# Altium schematic sheet Mechanical.SchDoc
size A4; CompanyName: TechOcean Sp. z o. o.; Address1: 02-639 Warszawa; Address2: Domaniewska 37A/119; Revision: 1.0; SheetNumber: 5; SheetTotal: 5
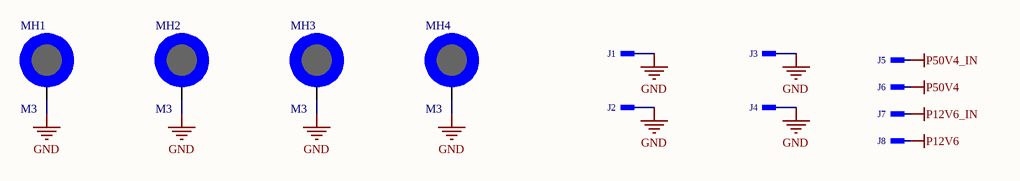
[diagram p0: Mechanical.SchDoc]

## Parts
J1  Pad  [PAD_SMD_S1200X500]  (value not drawn)  (no BOM)
J2  Pad  [PAD_SMD_S1200X500]  (value not drawn)  (no BOM)
J3  Pad  [PAD_SMD_S1200X500]  (value not drawn)  (no BOM)
J4  Pad  [PAD_SMD_S1200X500]  (value not drawn)  (no BOM)
J5  Pad  [PAD_SMD_S1200X500]  (value not drawn)  (no BOM)
J6  Pad  [PAD_SMD_S1200X500]  (value not drawn)  (no BOM)
J7  Pad  [PAD_SMD_S1200X500]  (value not drawn)  (no BOM)
J8  Pad  [PAD_SMD_S1200X500]  (value not drawn)  (no BOM)
MH1  M3  [MH-M3_COPPER_WASHER]  (no BOM)
MH2  M3  [MH-M3_COPPER_WASHER]  (no BOM)
MH3  M3  [MH-M3_COPPER_WASHER]  (no BOM)
MH4  M3  [MH-M3_COPPER_WASHER]  (no BOM)

## Nets
GND: J1.1 J2.1 J3.1 J4.1 MH1.MH MH2.MH MH3.MH MH4.MH
P12V6: J8.1
P12V6_IN: J7.1
P50V4: J6.1
P50V4_IN: J5.1

## Notes on the sheet
- Project:
- Variant:
- File:
- Sheet:
- Revision:
- Total Sheet:
- Politechnika Warszawska
- Wydział Elektryczny
- Pl. Politechniki 1
- Author:
- Piotr Czapnik
- Modified:
- 00-661 Warszawa

## Library data of the parts
J1-J8 = PAD_SMD_S1200X500: 12mm x  5mm SMD Pad with stitches; DesignItemId: PAD_SMD_S1200X500; Author: PC; Family: Pad; Part Description: 12mm x  5mm SMD Pad with stitches; Create Date: 14.03.2020; LatestRevisionDate: 14.03.2020
MH1-MH4 = MH-M3_CW: Mounting hole, M3, exposed pad, space for washer; DesignItemId: MH-M3_CW; Author: KB; Family: M3; Part Description: Mounting hole, M3, exposed pad, space for washer; Create Date: 19.05.2011; LatestRevisionDate: 19.05.2011